# Altium project Pick and place Robot.PrjPcb
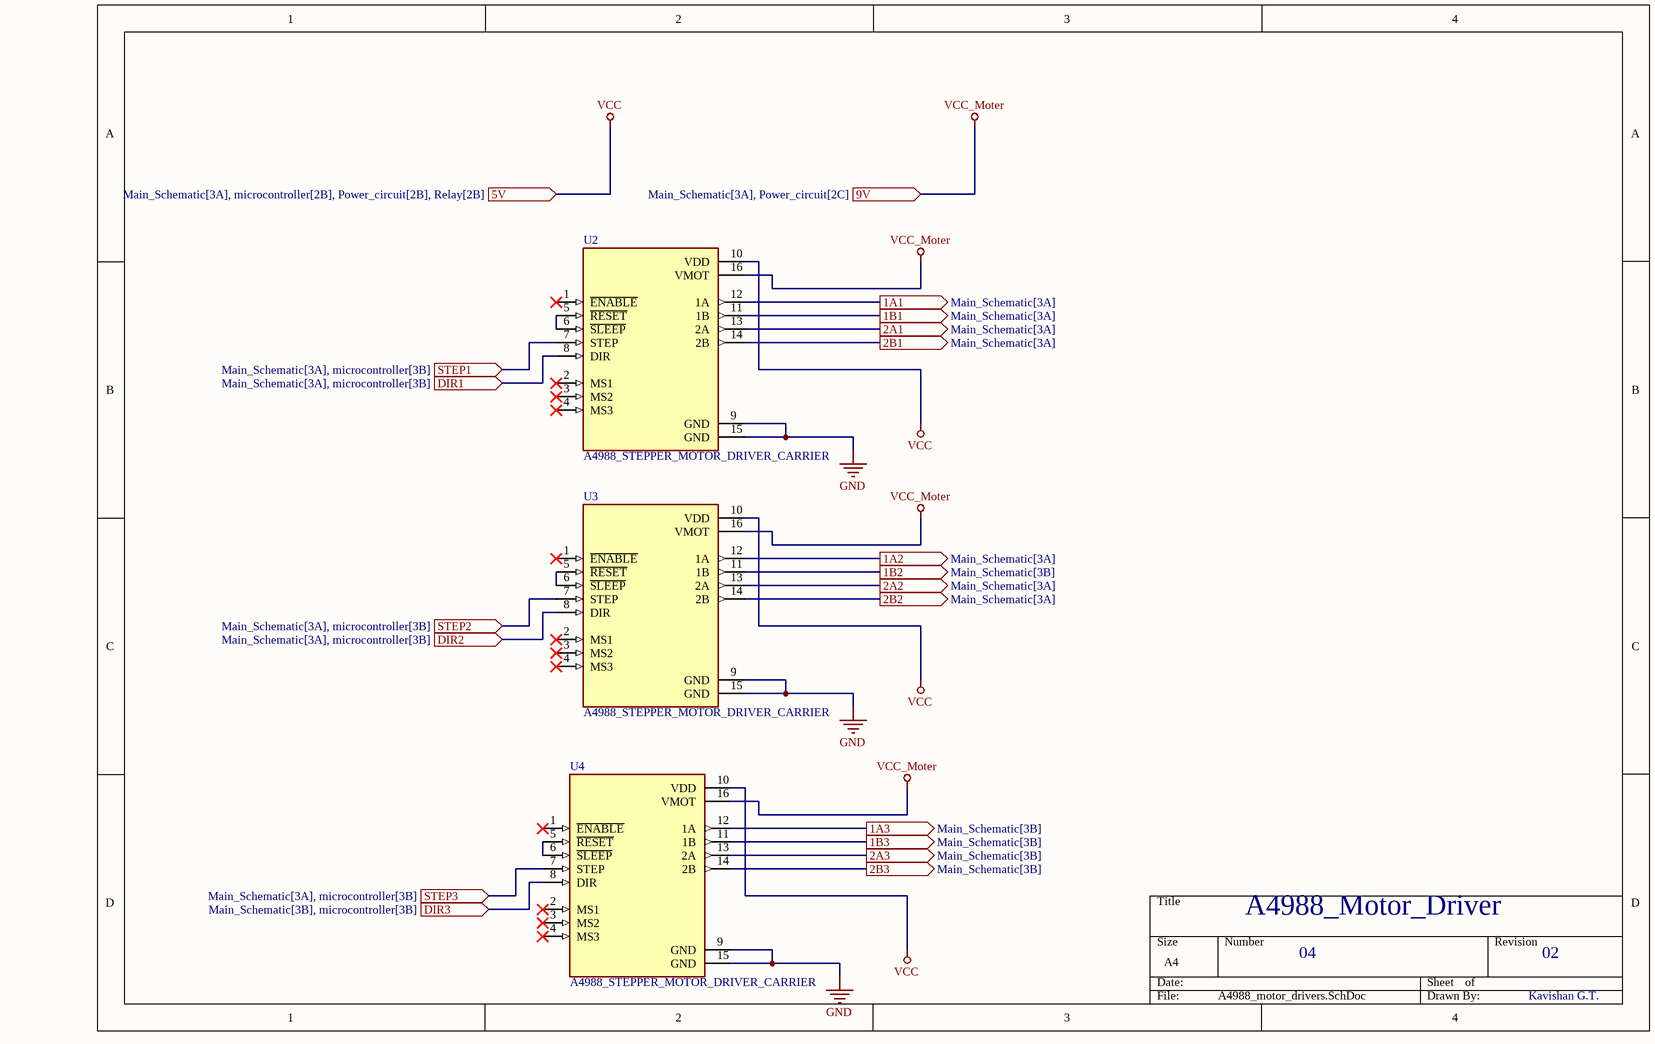
[diagram p0: A4988_motor_drivers.SchDoc]
1 sheet, 3 parts. Net scope: flat (ports and power ports of the same name join across sheets).
Board file: Main_pcb.PcbDoc

## Sheet A4988_motor_drivers.SchDoc
size A4; SheetNumber: 4; SheetTotal: 5

### Parts
U2  A4988_STEPPER_MOTOR_DRIVER_CARRIER  [MODULE_A4988_STEPPER_MOTOR_DRIVER_CARRIER]
U3  A4988_STEPPER_MOTOR_DRIVER_CARRIER  [MODULE_A4988_STEPPER_MOTOR_DRIVER_CARRIER]
U4  A4988_STEPPER_MOTOR_DRIVER_CARRIER  [MODULE_A4988_STEPPER_MOTOR_DRIVER_CARRIER]

### Ports
1A1 (out, see Main_Schematic[3A]), 1A2 (out, see Main_Schematic[3A]), 1A3 (out, see Main_Schematic[3B]), 1B1 (out, see Main_Schematic[3A]), 1B2 (out, see Main_Schematic[3B]), 1B3 (out, see Main_Schematic[3B]), 2A1 (out, see Main_Schematic[3A]), 2A2 (out, see Main_Schematic[3A]), 2A3 (out, see Main_Schematic[3B]), 2B1 (out, see Main_Schematic[3A]), 2B2 (out, see Main_Schematic[3A]), 2B3 (out, see Main_Schematic[3B]), 5V (in, see Main_Schematic[3A], microcontroller[2B], Power_circuit[2B], Relay[2B]), 9V (in, see Main_Schematic[3A], Power_circuit[2C]), DIR1 (in, see Main_Schematic[3A], microcontroller[3B]), DIR2 (in, see Main_Schematic[3A], microcontroller[3B]), DIR3 (in, see Main_Schematic[3B], microcontroller[3B]), STEP1 (in, see Main_Schematic[3A], microcontroller[3B]), STEP2 (in, see Main_Schematic[3A], microcontroller[3B]), STEP3 (in, see Main_Schematic[3A], microcontroller[3B])

### Nets
GND: U2.9(GND) U2.15(GND) U3.9(GND) U3.15(GND) U4.9(GND) U4.15(GND)
VCC: U2.10(VDD) U3.10(VDD) U4.10(VDD) ; port 5V
VCC_Moter: U2.16(VMOT) U3.16(VMOT) U4.16(VMOT) ; port 9V
NetU2_5: U2.5(~{RESET}) U2.6(~{SLEEP})
NetU2_7: U2.7(STEP) ; port STEP1
NetU2_8: U2.8(DIR) ; port DIR1
NetU2_11: U2.11(1B) ; port 1B1
NetU2_12: U2.12(1A) ; port 1A1
NetU2_13: U2.13(2A) ; port 2A1
NetU2_14: U2.14(2B) ; port 2B1
NetU3_5: U3.5(~{RESET}) U3.6(~{SLEEP})
NetU3_7: U3.7(STEP) ; port STEP2
NetU3_8: U3.8(DIR) ; port DIR2
NetU3_11: U3.11(1B) ; port 1B2
NetU3_12: U3.12(1A) ; port 1A2
NetU3_13: U3.13(2A) ; port 2A2
NetU3_14: U3.14(2B) ; port 2B2
NetU4_5: U4.5(~{RESET}) U4.6(~{SLEEP})
NetU4_7: U4.7(STEP) ; port STEP3
NetU4_8: U4.8(DIR) ; port DIR3
NetU4_11: U4.11(1B) ; port 1B3
NetU4_12: U4.12(1A) ; port 1A3
NetU4_13: U4.13(2A) ; port 2A3
NetU4_14: U4.14(2B) ; port 2B3

Not connected (* = marked no-connect by the designer): U2 1(~{ENABLE})* 2(MS1)* 3(MS2)* 4(MS3)*; U3 1(~{ENABLE})* 2(MS1)* 3(MS2)* 4(MS3)*; U4 1(~{ENABLE})* 2(MS1)* 3(MS2)* 4(MS3)*

### Notes on the sheet
- A4988_Motor_Driver
- 04
- 02
- Kavishan G.T.

### Library data of the parts
U2-U4 = A4988_STEPPER_MOTOR_DRIVER_CARRIER: Stepper motor controler; IC: A4988; 1A; Uin mot: 8Ã·35V; Price: None; Value: *; MP: A4988_STEPPER_MOTOR_DRIVER_CARRIER; Package: None; Availability: Unavailable